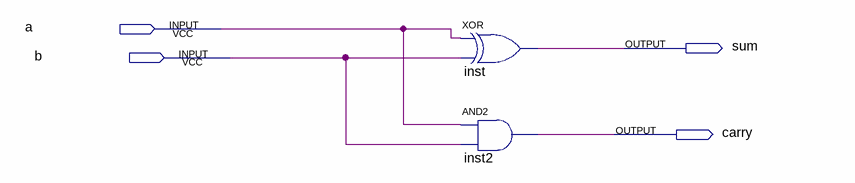
[diagram p0: schematic sheet]
// Quartus schematic half_adder.bdf as structural Verilog: 2 symbols, 4 pins
module half_adder (
  input  a,
  input  b,
  output sum,
  output carry
);

  xor inst (sum, a, b);
  and inst2 (carry, a, b);
endmodule
